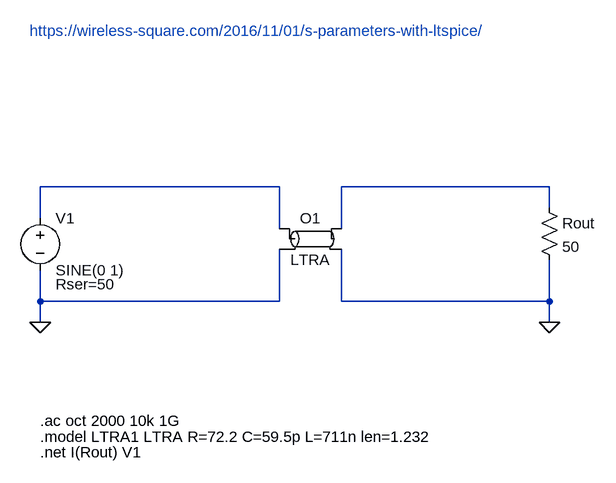
[diagram p0: schematic sparam_4ftucryomanginintwp_floatingshield.asc]
sparam_4ftucryomanginintwp_floatingshield.asc, the LTspice schematic file:
Version 4
SHEET 1 1416 680
WIRE -512 176 -880 176
WIRE -96 176 -416 176
WIRE -96 208 -96 176
WIRE -880 224 -880 176
WIRE -512 240 -512 176
WIRE -416 240 -416 176
WIRE -880 352 -880 304
WIRE -512 352 -512 272
WIRE -512 352 -880 352
WIRE -416 352 -416 272
WIRE -96 352 -96 288
WIRE -96 352 -416 352
WIRE -880 384 -880 352
WIRE -96 384 -96 352
FLAG -880 384 0
FLAG -96 384 0
SYMBOL voltage -880 208 R0
WINDOW 39 24 118 Left 2
SYMATTR SpiceLine Rser=50
SYMATTR InstName V1
SYMATTR Value SINE(0 1)
SYMBOL res -112 192 R0
SYMATTR InstName Rout
SYMATTR Value 50
SYMBOL ltline -464 256 R0
SYMATTR InstName O1
SYMATTR SpiceModel LTRA1
TEXT -880 536 Left 2 !.ac oct 2000 10k 1G
TEXT -880 584 Left 2 !.net I(Rout) V1
TEXT -896 -64 Left 2 ;https://wireless-square.com/2016/11/01/s-parameters-with-ltspice/
TEXT -880 560 Left 2 !.model LTRA1 LTRA R=72.2 C=59.5p L=711n len=1.232

The netlist it stands for:
* sparam_4ftucryomanginintwp_floatingshield.asc
V1 N001 0 SINE(0 1) Rser=50
Rout N002 0 50
O1 N001 0 N002 0 LTRA1 LTRA
.ac oct 2000 10k 1G
.net I(Rout) V1
* https://wireless-square.com/2016/11/01/s-parameters-with-ltspice/
.model LTRA1 LTRA R=72.2 C=59.5p L=711n len=1.232
.backanno
.end